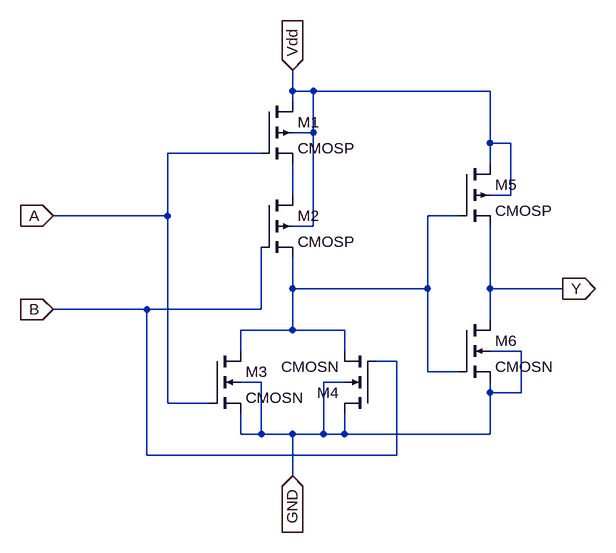
[diagram p0: schematic or_cmos.asc]
or_cmos.asc, the LTspice schematic file:
Version 4
SHEET 1 880 752
WIRE 208 48 208 16
WIRE 240 48 208 48
WIRE 512 48 240 48
WIRE 208 64 208 48
WIRE 240 112 240 48
WIRE 240 112 208 112
WIRE 512 128 512 48
WIRE 544 128 512 128
WIRE 160 144 16 144
WIRE 512 160 512 128
WIRE 208 208 208 160
WIRE 544 208 544 128
WIRE 544 208 512 208
WIRE 16 240 16 144
WIRE 16 240 -160 240
WIRE 464 240 416 240
WIRE 240 256 240 112
WIRE 240 256 208 256
WIRE 208 352 208 304
WIRE 416 352 416 240
WIRE 416 352 208 352
WIRE 512 352 512 256
WIRE 624 352 512 352
WIRE -16 384 -160 384
WIRE 160 384 160 288
WIRE 160 384 -16 384
WIRE 512 400 512 352
WIRE 208 416 208 352
WIRE 208 416 128 416
WIRE 288 416 208 416
WIRE 128 448 128 416
WIRE 288 448 288 416
WIRE 560 448 512 448
WIRE 368 464 336 464
WIRE 416 480 416 352
WIRE 464 480 416 480
WIRE 160 496 128 496
WIRE 288 496 256 496
WIRE 512 512 512 496
WIRE 560 512 560 448
WIRE 560 512 512 512
WIRE 16 528 16 240
WIRE 80 528 16 528
WIRE 128 576 128 544
WIRE 160 576 160 496
WIRE 160 576 128 576
WIRE 208 576 160 576
WIRE 256 576 256 496
WIRE 256 576 208 576
WIRE 288 576 288 544
WIRE 288 576 256 576
WIRE 512 576 512 512
WIRE 512 576 288 576
WIRE -16 608 -16 384
WIRE 368 608 368 464
WIRE 368 608 -16 608
WIRE 208 640 208 576
FLAG -160 240 A
IOPIN -160 240 In
FLAG -160 384 B
IOPIN -160 384 In
FLAG 208 16 Vdd
IOPIN 208 16 In
FLAG 208 640 GND
IOPIN 208 640 In
FLAG 624 352 Y
IOPIN 624 352 Out
SYMBOL cmosp 160 64 R0
SYMATTR InstName M1
SYMATTR Value2 l=180n w=1u
SYMBOL cmosp 160 208 R0
SYMATTR InstName M2
SYMATTR Value2 l=180n w=1u
SYMBOL cmosn 80 448 R0
SYMATTR InstName M3
SYMATTR Value2 l=180n w=1u
SYMBOL cmosn 336 544 R180
SYMATTR InstName M4
SYMATTR Value2 l=180n w=1u
SYMBOL cmosp 464 160 R0
SYMATTR InstName M5
SYMATTR Value2 l=180n w=1u
SYMBOL cmosn 464 400 R0
SYMATTR InstName M6
SYMATTR Value2 l=180n w=1u

The netlist it stands for:
* or_cmos.asc
M1 Vdd A N001 Vdd CMOSP l=180n w=1u
M2 N001 B N002 Vdd CMOSP l=180n w=1u
M3 N002 A GND GND CMOSN l=180n w=1u
M4 GND B N002 GND CMOSN l=180n w=1u
M5 Vdd N002 Y Vdd CMOSP l=180n w=1u
M6 Y N002 GND GND CMOSN l=180n w=1u
.model NMOS NMOS
.model PMOS PMOS
.lib standard.mos
.backanno
.end